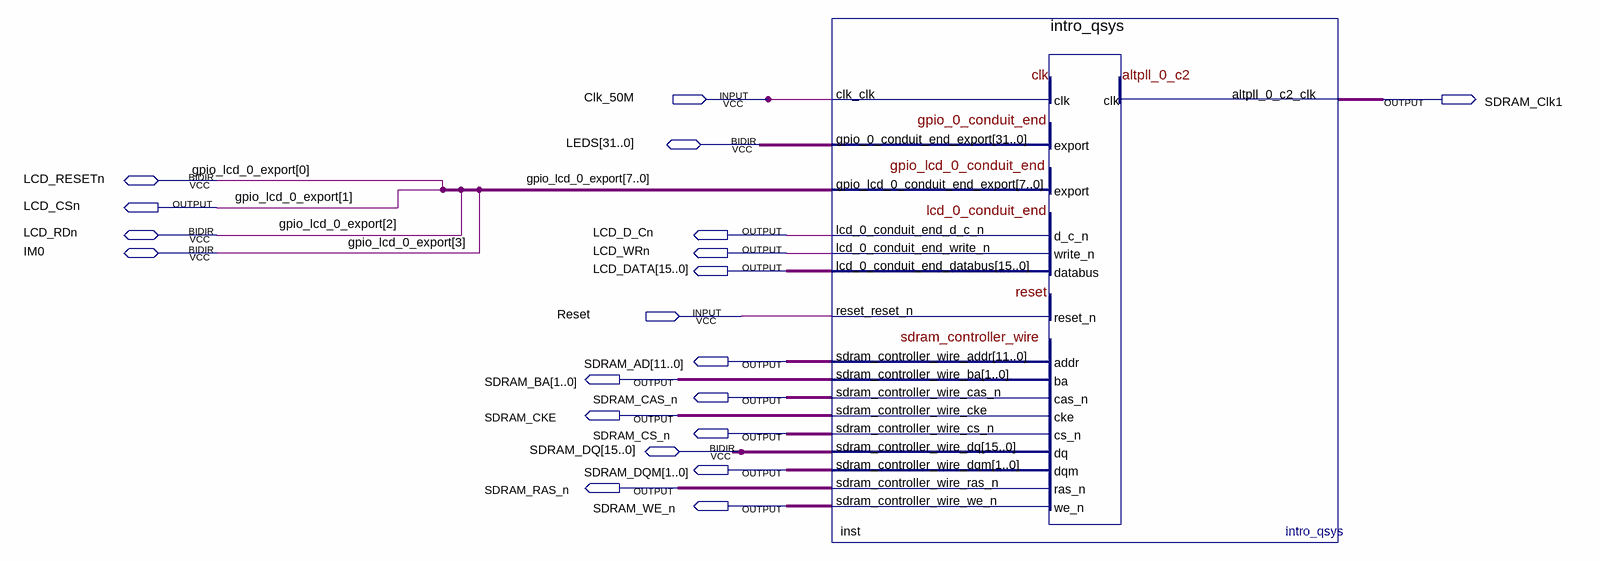
[diagram p0: schematic sheet]
// Quartus schematic Intro.bdf as structural Verilog: 1 symbols, 20 pins
module Intro (
  input  Clk_50M,
  input  Reset,
  inout  [31:0] LEDS,
  inout  LCD_RESETn,
  inout  LCD_RDn,
  inout  IM0,
  inout  [15:0] SDRAM_DQ,
  output SDRAM_Clk1,
  output LCD_CSn,
  output LCD_D_Cn,
  output LCD_WRn,
  output [15:0] LCD_DATA,
  output [11:0] SDRAM_AD,
  output [1:0] SDRAM_BA,
  output SDRAM_CAS_n,
  output SDRAM_CKE,
  output SDRAM_CS_n,
  output [1:0] SDRAM_DQM,
  output SDRAM_RAS_n,
  output SDRAM_WE_n
);

  wire [7:4] gpio_lcd_0_export;

  intro_qsys inst (
    .clk_clk(Clk_50M), .reset_reset_n(Reset), .altpll_0_c2_clk(SDRAM_Clk1),
    .lcd_0_conduit_end_d_c_n(LCD_D_Cn), .lcd_0_conduit_end_write_n(LCD_WRn),
    .lcd_0_conduit_end_databus(LCD_DATA), .sdram_controller_wire_addr(SDRAM_AD),
    .sdram_controller_wire_ba(SDRAM_BA), .sdram_controller_wire_cas_n(SDRAM_CAS_n),
    .sdram_controller_wire_cke(SDRAM_CKE), .sdram_controller_wire_cs_n(SDRAM_CS_n),
    .sdram_controller_wire_dqm(SDRAM_DQM), .sdram_controller_wire_ras_n(SDRAM_RAS_n),
    .sdram_controller_wire_we_n(SDRAM_WE_n), .gpio_0_conduit_end_export(LEDS),
    .gpio_lcd_0_conduit_end_export({gpio_lcd_0_export, IM0, LCD_RDn, LCD_CSn, LCD_RESETn}),
    .sdram_controller_wire_dq(SDRAM_DQ));

  // Other names for the same wires on the sheet: gpio_lcd_0_export[3:0] = {IM0, LCD_RDn, LCD_CSn, LCD_RESETn}
endmodule
